# Altium schematic sheet 3 mcu.SchDoc
size A4; SheetNumber: 3; SheetTotal: 4
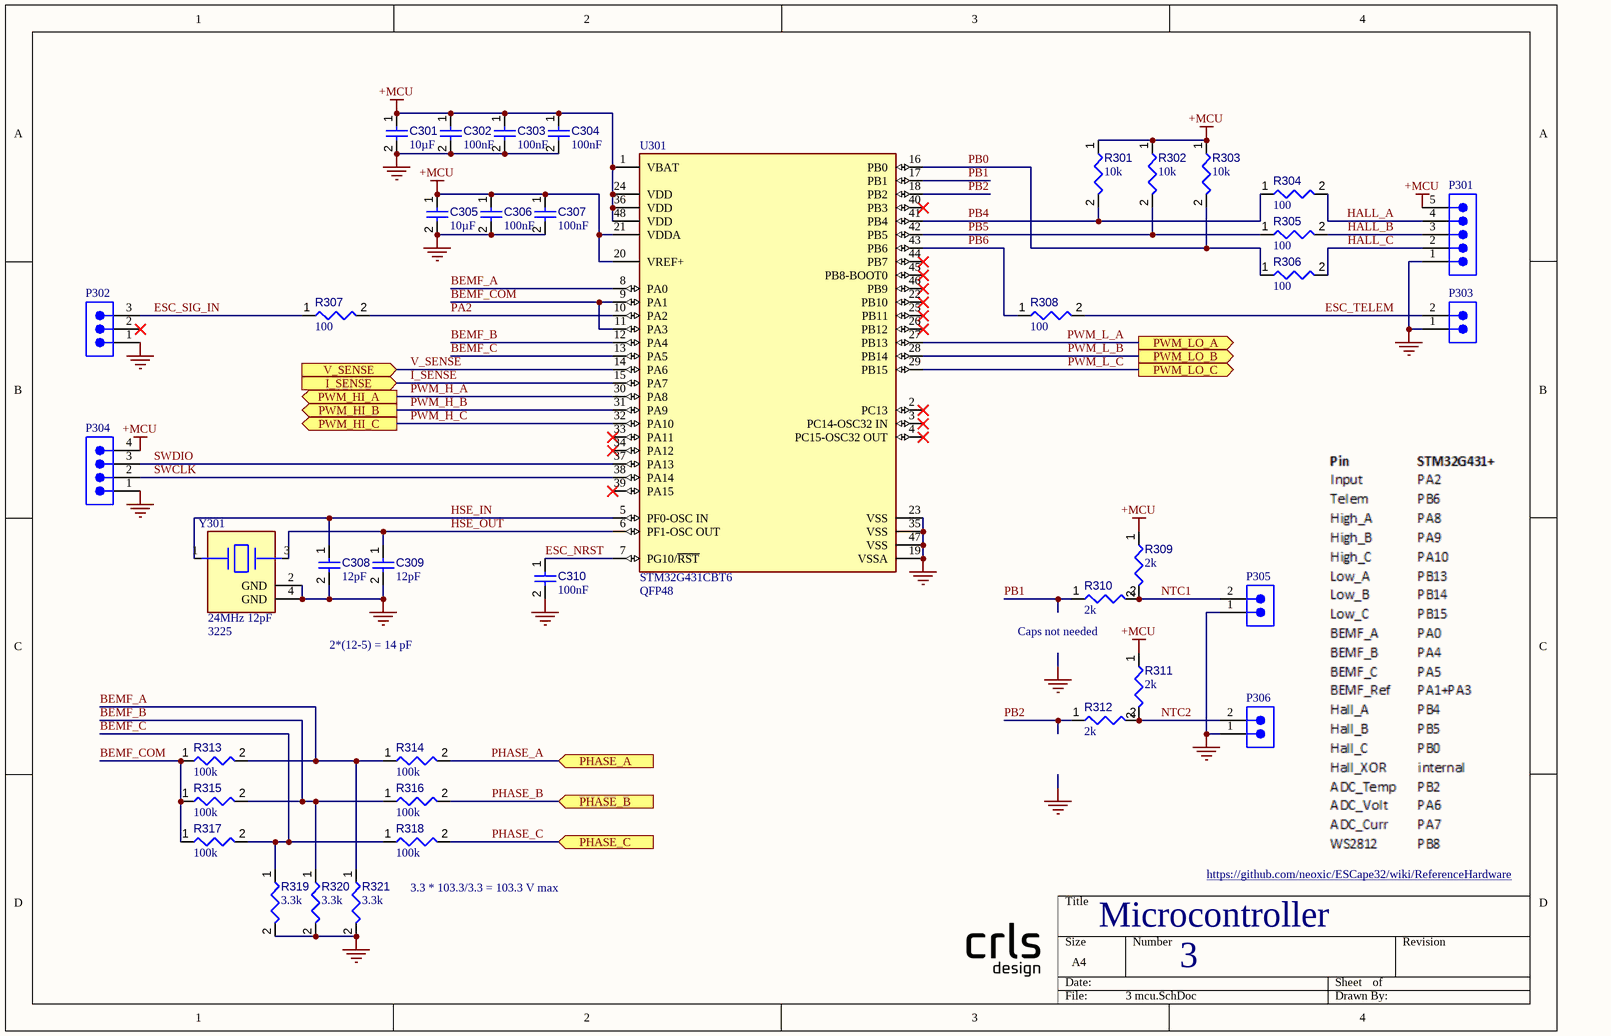
[diagram p0: 3 mcu.SchDoc]

## Parts
C301  value 10µF  [CAPC0603(1608)100_L]  (hidden comment: Capacitor 10µF +/-20% 10V 0603)
C302  value 100nF  [CAPC0402(1005)60_L]  (hidden comment: Capacitor 100nF +/-20% 25V 0402)
C303  value 100nF  [CAPC0402(1005)60_L]  (hidden comment: Capacitor 100nF +/-20% 25V 0402)
C304  value 100nF  [CAPC0402(1005)60_L]  (hidden comment: Capacitor 100nF +/-20% 25V 0402)
C305  value 10µF  [CAPC0603(1608)100_L]  (hidden comment: Capacitor 10µF +/-20% 10V 0603)
C306  value 100nF  [CAPC0402(1005)60_L]  (hidden comment: Capacitor 100nF +/-20% 25V 0402)
C307  value 100nF  [CAPC0402(1005)60_L]  (hidden comment: Capacitor 100nF +/-20% 25V 0402)
C308  value 12pF  [CAPC0402(1005)33_L]  (hidden comment: Capacitor 12pF +/-10% 50V 0402)
C309  value 12pF  [CAPC0402(1005)33_L]  (hidden comment: Capacitor 12pF +/-10% 50V 0402)
C310  value 100nF  [CAPC0402(1005)60_L]  (hidden comment: Capacitor 100nF +/-20% 25V 0402)
P301  61300511121  [61300511121]  (value not drawn)
P302  62000311121  [62000311121]  (value not drawn)
P303  62000211121  [62000211121]  (value not drawn)
P304  61300411121  [61300411121]  (value not drawn)
P305  62000211121  [62000211121]  (value not drawn)
P306  62000211121  [62000211121]  (value not drawn)
R301  value 10k  [RESC0402(1005)_L]  (hidden comment: Resistor 10K  +/-1 % 0402 63 mW)
R302  value 10k  [RESC0402(1005)_L]  (hidden comment: Resistor 10K  +/-1 % 0402 63 mW)
R303  value 10k  [RESC0402(1005)_L]  (hidden comment: Resistor 10K  +/-1 % 0402 63 mW)
R304  value 100  [RESC0402(1005)_L]  (hidden comment: Resistor 100R +/-1 % 0402 63 mW)
R305  value 100  [RESC0402(1005)_L]  (hidden comment: Resistor 100R +/-1 % 0402 63 mW)
R306  value 100  [RESC0402(1005)_L]  (hidden comment: Resistor 100R +/-1 % 0402 63 mW)
R307  value 100  [RESC0402(1005)_L]  (hidden comment: Resistor 100R +/-1 % 0402 63 mW)
R308  value 100  [RESC0402(1005)_L]  (hidden comment: Resistor 100R +/-1 % 0402 63 mW)
R309  value 2k  [RESC0402(1005)_L]  (hidden comment: Resistor 2K +/-5 % 0402 63 mW)
R310  value 2k  [RESC0402(1005)_L]  (hidden comment: Resistor 2K +/-5 % 0402 63 mW)
R311  value 2k  [RESC0402(1005)_L]  (hidden comment: Resistor 2K +/-5 % 0402 63 mW)
R312  value 2k  [RESC0402(1005)_L]  (hidden comment: Resistor 2K +/-5 % 0402 63 mW)
R313  value 100k  [RESC0402(1005)_L]  (hidden comment: Resistor 100K +/-1 % 0402 63 mW)
R314  value 100k  [RESC0402(1005)_L]  (hidden comment: Resistor 100K +/-1 % 0402 63 mW)
R315  value 100k  [RESC0402(1005)_L]  (hidden comment: Resistor 100K +/-1 % 0402 63 mW)
R316  value 100k  [RESC0402(1005)_L]  (hidden comment: Resistor 100K +/-1 % 0402 63 mW)
R317  value 100k  [RESC0402(1005)_L]  (hidden comment: Resistor 100K +/-1 % 0402 63 mW)
R318  value 100k  [RESC0402(1005)_L]  (hidden comment: Resistor 100K +/-1 % 0402 63 mW)
R319  value 3.3k  [RESC0402(1005)_L]  (hidden comment: Resistor 3K3 +/-1 % 0402 63 mW)
R320  value 3.3k  [RESC0402(1005)_L]  (hidden comment: Resistor 3K3 +/-1 % 0402 63 mW)
R321  value 3.3k  [RESC0402(1005)_L]  (hidden comment: Resistor 3K3 +/-1 % 0402 63 mW)
U301  STM32G431CBT6  [FP-LQFP48-5B-MFG]
Y301  TSX-3225 24.0000MF20G-AC3  [FP-TSX-3225-MFG]  (value not drawn)

## Ports
I_SENSE (in), PHASE_A (in), PHASE_B (in), PHASE_C (in), PWM_HI_A (out), PWM_HI_B (out), PWM_HI_C (out), PWM_LO_A (out), PWM_LO_B (out), PWM_LO_C (out), V_SENSE (in)

## Nets
+MCU: C301.1 C302.1 C303.1 C304.1 C305.1 C306.1 C307.1 P301.5 P304.4 R301.1 R302.1 R303.1 R309.1 R311.1 U301.1(VBAT) U301.20(VREF+) U301.21(VDDA) U301.24(VDD) U301.36(VDD) U301.48(VDD)
GND: C301.2 C302.2 C303.2 C304.2 C305.2 C306.2 C307.2 C308.2 C309.2 C310.2 P301.1 P302.1 P303.1 P304.1 P305.1 P306.1 R319.2 R320.2 R321.2 U301.19(VSSA) U301.23(VSS) U301.35(VSS) U301.47(VSS) Y301.2(GND) Y301.4(GND)
BEMF_A: R313.2 R314.1 R321.1 U301.8(PA0)
BEMF_B: R315.2 R316.1 R320.1 U301.12(PA4)
BEMF_C: R317.2 R318.1 R319.1 U301.13(PA5)
BEMF_COM: R313.1 R315.1 R317.1 U301.9(PA1) U301.11(PA3)
ESC_NRST: C310.1 U301.7(PG10/~{RST})
ESC_SIG_IN: P302.3 R307.1
ESC_TELEM: P303.2 R308.2
HALL_A: P301.4 R304.2
HALL_B: P301.3 R305.2
HALL_C: P301.2 R306.2
HSE_IN: C308.1 U301.5(PF0-OSC_IN) Y301.1
HSE_OUT: C309.1 U301.6(PF1-OSC_OUT) Y301.3
I_SENSE: U301.15(PA7) ; port I_SENSE
NTC1: P305.2 R309.2 R310.2
NTC2: P306.2 R311.2 R312.2
PA2: R307.2 U301.10(PA2)
PB0: R303.2 R306.1 U301.16(PB0)
PB1: R310.1 U301.17(PB1)
PB2: R312.1 U301.18(PB2)
PB4: R301.2 R304.1 U301.41(PB4)
PB5: R302.2 R305.1 U301.42(PB5)
PB6: R308.1 U301.43(PB6)
PHASE_A: R314.2 ; port PHASE_A
PHASE_B: R316.2 ; port PHASE_B
PHASE_C: R318.2 ; port PHASE_C
PWM_H_A: U301.30(PA8) ; port PWM_HI_A
PWM_H_B: U301.31(PA9) ; port PWM_HI_B
PWM_H_C: U301.32(PA10) ; port PWM_HI_C
PWM_L_A: U301.27(PB13) ; port PWM_LO_A
PWM_L_B: U301.28(PB14) ; port PWM_LO_B
PWM_L_C: U301.29(PB15) ; port PWM_LO_C
SWCLK: P304.2 U301.38(PA14)
SWDIO: P304.3 U301.37(PA13)
V_SENSE: U301.14(PA6) ; port V_SENSE

Not connected (* = marked no-connect by the designer): P302 2*; U301 2(PC13)* 3(PC14-OSC32_IN)* 4(PC15-OSC32_OUT)* 22(PB10)* 25(PB11)* 26(PB12)* 33(PA11)* 34(PA12)* 39(PA15)* 40(PB3)* 44(PB7)* 45(PB8-BOOT0)* 46(PB9)*

## Notes on the sheet
- (near Y301) 24MHz 12pF
- (near Y301) 3225
- 2*(12-5) = 14 pF
- (near U301) QFP48
- Caps not needed
- 3.3 * 103.3/3.3 = 103.3 V max
- https://github.com/neoxic/ESCape32/wiki/ReferenceHardware
- Microcontroller

## Library data of the parts
C301 C305 = CMP-001-00075-4: Chip Capacitor, 10µF +/-20%, 10V, 0603, Thickness 1 mm; Tolerance: 10%; Voltage Rating: 10V; Max Operating Temperature: 85°C; Pins: 2; Case/Package: 0603; Mounting Technology: SMT; Min Operating Temperature: -55°C
C302-C304 C306 C307 C310 = CMP-001-00065-4: Chip Capacitor, 100nF +/-20%, 25V, 0402, Thickness 0.6 mm; Tolerance: 10%; Max Operating Temperature: 85°C; Min Operating Temperature: -55°C; Pins: 2; Voltage Rating: 25V; Mounting Technology: SMT; Case/Package: 0402
C308 C309 = CMP-001-00072-4: Chip Capacitor, 12pF +/-10%, 50V, 0402, Thickness 0.33 mm; Tolerance: 20%; Pins: 2; Max Operating Temperature: 85°C; Case/Package: 0402; Voltage Rating: 50V; Mounting Technology: SMT; Min Operating Temperature: -55°C
P301 = CMP-1502-01068-3: NexarPartId: 32855526; Connector Type: Male Pin; Gender: Male; Contact Resistance: 20mΩ; Pitch: 2.54mm; Operating Supply Voltage: 250V; Current Rating: 3A; Number of Contacts: 5; Lead Free: Lead Free; Color: Black; Packaging: Bulk; Lead Pitch: 2.54mm; Contact Material: Copper; Min Operating Temperature: -40°C; Contact Mating Length: 5.9944mm; Voltage Rating: 250V; Number of Pins: 5; Number of Positions: 5; Height: 8.89mm; Orientation: Vertical; REACH SVHC: Unknown; RoHS: Compliant; Contact Plating: Gold; Max Operating Temperature: 105°C; Mount: Through Hole; Number of Rows: 1; Termination: Solder
P302 = CMP-1502-00957-4: NexarPartId: 61924779; Contact Resistance: 20mΩ; Voltage Rating: 200V; Current Rating: 2A; Number of Contacts: 3; Gender: Male; Max Operating Temperature: 105°C; Min Operating Temperature: -40°C; Number of Pins: 3; RoHS: Non-Compliant; Contact Material: Gold; Height: 6.35mm; Operating Supply Voltage: 200V; Number of Rows: 1; Lead Pitch: 2mm; Orientation: Vertical
P303 P305 P306 = CMP-1502-00956-4: NexarPartId: 61924778; Current Rating: 2A; Operating Supply Voltage: 200V; Contact Resistance: 20mΩ; Number of Contacts: 2; Gender: Male; RoHS: Non-Compliant; Max Operating Temperature: 105°C; Voltage Rating: 200V; Contact Material: Gold; Height: 6.35mm; Number of Rows: 1; Lead Pitch: 2mm; Min Operating Temperature: -40°C; Number of Pins: 2; Orientation: Vertical
P304 = CMP-1502-01064-3: NexarPartId: 32855522; Operating Supply Voltage: 250V; Pitch: 2.54mm; Contact Resistance: 20mΩ; Number of Positions: 4; Current Rating: 3A; Connector Type: Male Pin; Gender: Male; Contact Plating: Gold; Height: 8.89mm; Lead Pitch: 2.54mm; Lead Free: Lead Free; Contact Mating Length: 5.9944mm; Number of Rows: 1; Termination: Solder; Packaging: Bulk; REACH SVHC: Unknown; Min Operating Temperature: -40°C; RoHS: Compliant; Number of Contacts: 4; Voltage Rating: 250V; Color: Black; Max Operating Temperature: 105°C; Contact Material: Copper; Mount: Through Hole; Orientation: Vertical; Number of Pins: 4
R301-R303 = CMP-009-00149-3: Chip Resistor, 10 kOhms, +/-1 %, 63 mW, -55 to 125 degC, 0402; Power: 63mW; Tolerance: 1%; Min Operating Temperature: -55°C; Case/Package: 0402; Max Operating Temperature: 155°C; Pins: 2
R304-R308 = CMP-009-00167-3: Chip Resistor, 100 Ohms, +/-1 %, 63 mW, -55 to 155 degC, 0402; Power: 63mW; Tolerance: 1%; Min Operating Temperature: -55°C; Case/Package: 0402; Pins: 2; Max Operating Temperature: 155°C
R309-R312 = CMP-009-00138-3: Chip Resistor, 2 kOhms, +/-5 %, 63 mW, -55 to 155 degC, 0402; Tolerance: 5%; Power: 63mW; Max Operating Temperature: 155°C; Pins: 2; Min Operating Temperature: -55°C; Case/Package: 0402
R313-R318 = CMP-009-00168-3: Chip Resistor, 100 kOhms, +/-1 %, 63 mW, -55 to 155 degC, 0402; Tolerance: 1%; Power: 63mW; Max Operating Temperature: 155°C; Min Operating Temperature: -55°C; Pins: 2; Case/Package: 0402
R319-R321 = CMP-009-00145-3: Chip Resistor, 3.3 kOhms, +/-1 %, 63 mW, -55 to 155 degC, 0402; Tolerance: 1%; Power: 63mW; Case/Package: 0402; Min Operating Temperature: -55°C; Max Operating Temperature: 155°C; Pins: 2
U301 = CMP-12105-000030-1: MAINSTREAM ARM CORTEX-M4+ MCU 17; Manufacturer: STMicroelectronics; Number Of Adc Channels: 17; Number Of I/Os: 38; Standoff Height: 0.05mm; Number Of Usb Channels: 1; Data Bus Width: 32bits; Number Of I2C Channels: 3; Number Of Pwm Channels: 31; Frequency: 170MHz; Memory Type: FLASH; Number Of Timers/Counters: 14; Ram Size: 32KBytes; Max Junction Temp: +105°C; Memory Size: 128KBytes; Min Supply Voltage: 1.62V; Max Supply Voltage: 3.6V; Number Of Uart Channels: 4; Interface: I2C,SPI,UART,USART,CAN,USB,LIN,IrDA,I2S; Temperature Range Low: -40°C; Lead Free: Yes; Device Class L3: Microcontrollers; Number Of Cores: 1; Temperature Range High: +85°C; Height: 1.6mm; Digikey Description: MAINSTREAM ARM CORTEX-M4+ MCU 17; Device Class L1: Integrated Circuits (ICs); Package: LQFP48-5B; RoHS: TRUE; Number Of A/D Converters: 1; Core Architecture: Arm Cortex-M4; Device Class L2: Embedded Processors and Controllers; ComponentLink2Description: Datasheet; Temperature: -40°C to +85°C; Ambient Temperature Range High: +85°C; Ambient Temperature Range Low: -40°C; Octopart: https://octopart.com/stm32g431cbt6-stmicroelectronics-98835224; ComponentLink2URL: https://www.st.com/resource/en/datasheet/stm32g431cb.pdf; Automotive: No; Number Of Spi Channels: 3; Manufacturer Part Number: STM32G431CBT6; Category: IC
Y301 = CMP-36405-000018-1: CRYSTAL 24.0000MHZ 9PF SMD; ESR (Equivalent Series Resistance): 40R; Frequency Stability: 20ppm; Frequency: 24MHz; Tolerance: 10ppm; Drive Level: 200uW; Min Operating Temperature: -40°C; RoHS Compliant: Yes; Width: 2.5mm; Max Operating Temperature: 105°C; Package Quantity: 250; Load Capacitance: 9pF; Mount: Surface Mount; Lead Free: Lead Free; Height: 0.024inch; Depth: 2.5mm; Packaging: Tape and Reel; Series: TSX-3225; Weight: 0.000564oz; Number of Pins: 4; Termination: SMD/SMT; Case/Package: SMD/SMT; Length: 3.2mm; Frequency Tolerance: 10ppm